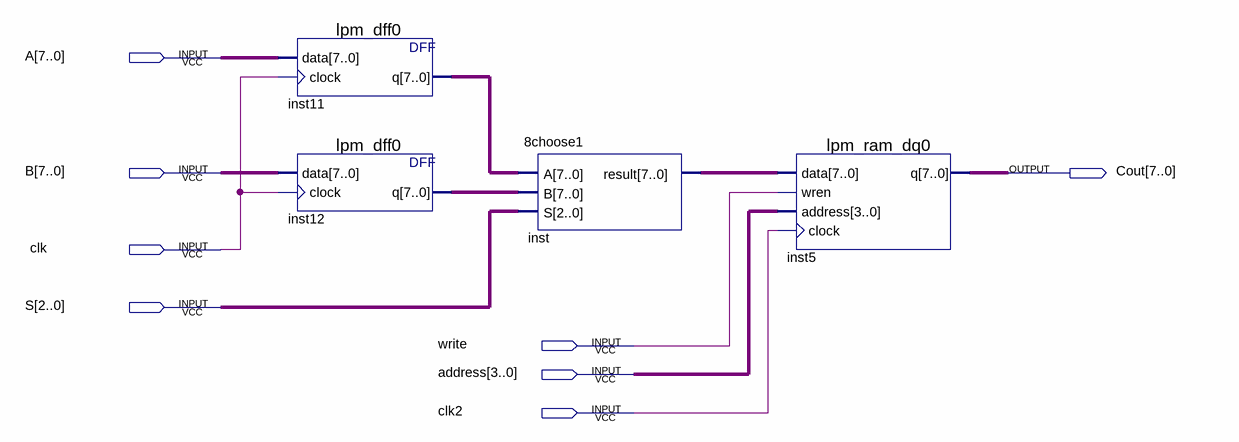
[diagram p0: schematic sheet]
// Quartus schematic CPU_8bit_stock.bdf as structural Verilog: 4 symbols, 8 pins
module CPU_8bit_stock (
  input  [7:0] A,
  input  [7:0] B,
  input  clk,
  input  [2:0] S,
  input  write,
  input  [3:0] address,
  input  clk2,
  output [7:0] Cout
);

  wire [7:0] inst11_q, inst12_q, inst_result;

  lpm_dff0 inst11 (.data(A), .clock(clk), .q(inst11_q));
  lpm_dff0 inst12 (.data(B), .clock(clk), .q(inst12_q));
  \8choose1  inst (.A(inst11_q), .B(inst12_q), .S(S), .result(inst_result));
  lpm_ram_dq0 inst5 (.data(inst_result), .wren(write), .address(address), .clock(clk2), .q(Cout));
endmodule
